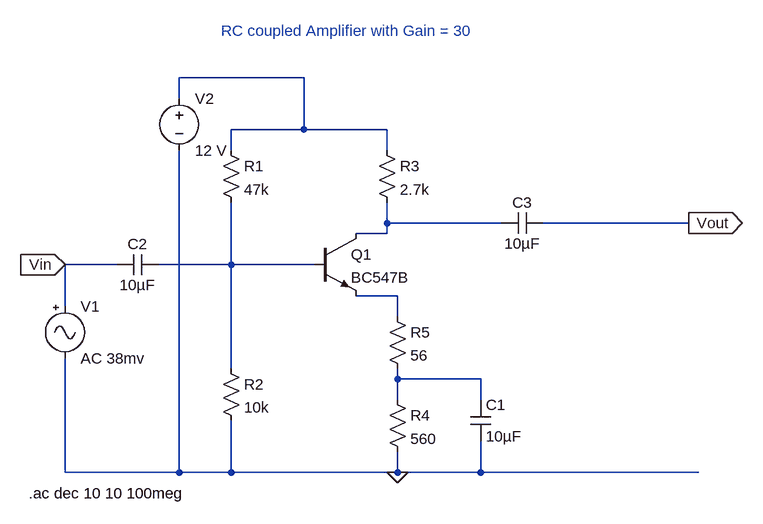
[diagram p0: schematic rcCoupleAmp4.asc]
rcCoupleAmp4.asc, the LTspice schematic file:
Version 4
SHEET 1 880 680
WIRE 0 -112 -192 -112
WIRE -192 -80 -192 -112
WIRE 0 -32 0 -112
WIRE 0 -32 -112 -32
WIRE 128 -32 0 -32
WIRE -112 0 -112 -32
WIRE 128 0 128 -32
WIRE 128 112 128 80
WIRE 304 112 128 112
WIRE 592 112 368 112
WIRE 128 128 128 112
WIRE 128 128 80 128
WIRE -288 176 -368 176
WIRE -112 176 -112 80
WIRE -112 176 -224 176
WIRE 16 176 -112 176
WIRE 144 224 80 224
WIRE -368 240 -368 176
WIRE 144 256 144 224
WIRE -112 336 -112 176
WIRE 144 352 144 336
WIRE 272 352 144 352
WIRE 144 384 144 352
WIRE 272 384 272 352
WIRE -368 496 -368 320
WIRE -192 496 -192 0
WIRE -192 496 -368 496
WIRE -112 496 -112 416
WIRE -112 496 -192 496
WIRE 144 496 144 464
WIRE 144 496 -112 496
WIRE 272 496 272 448
WIRE 272 496 144 496
WIRE 608 496 272 496
FLAG 144 496 0
FLAG -368 176 Vin
IOPIN -368 176 In
FLAG 592 112 Vout
IOPIN 592 112 Out
SYMBOL Misc\\signal -368 224 R0
WINDOW 123 0 0 Left 0
WINDOW 39 0 0 Left 0
SYMATTR InstName V1
SYMATTR Value AC 38mv
SYMBOL npn 16 128 R0
SYMATTR InstName Q1
SYMATTR Value BC547B
SYMBOL res -128 -16 R0
SYMATTR InstName R1
SYMATTR Value 47k
SYMBOL res -128 320 R0
SYMATTR InstName R2
SYMATTR Value 10k
SYMBOL res 112 -16 R0
SYMATTR InstName R3
SYMATTR Value 2.7k
SYMBOL res 128 368 R0
SYMATTR InstName R4
SYMATTR Value 560
SYMBOL cap 256 384 R0
SYMATTR InstName C1
SYMATTR Value 10µF
SYMBOL cap -224 160 R90
WINDOW 0 0 32 VBottom 2
WINDOW 3 32 32 VTop 2
SYMATTR InstName C2
SYMATTR Value 10µF
SYMBOL cap 368 96 R90
WINDOW 0 0 32 VBottom 2
WINDOW 3 32 32 VTop 2
SYMATTR InstName C3
SYMATTR Value 10µF
SYMBOL voltage -192 -96 R0
SYMATTR InstName V2
SYMATTR Value 12 V
SYMBOL res 128 240 R0
SYMATTR InstName R5
SYMATTR Value 56
TEXT -424 528 Left 2 !.ac dec 10 10 100meg
TEXT -128 -184 Left 2 ;RC coupled Amplifier with Gain = 30

The netlist it stands for:
* rcCoupleAmp4.asc
V1 Vin 0 AC 38mv
Q1 N002 N003 N004 0 BC547B
R1 N001 N003 47k
R2 N003 0 10k
R3 N001 N002 2.7k
R4 N005 0 560
C1 N005 0 10µF
C2 N003 Vin 10µF
C3 Vout N002 10µF
V2 N001 0 12 V
R5 N004 N005 56
.model NPN NPN
.model PNP PNP
.lib standard.bjt
.ac dec 10 10 100meg
* RC coupled Amplifier with Gain = 30
.backanno
.end